# Altium project DISPLAY_T12.PrjPcb
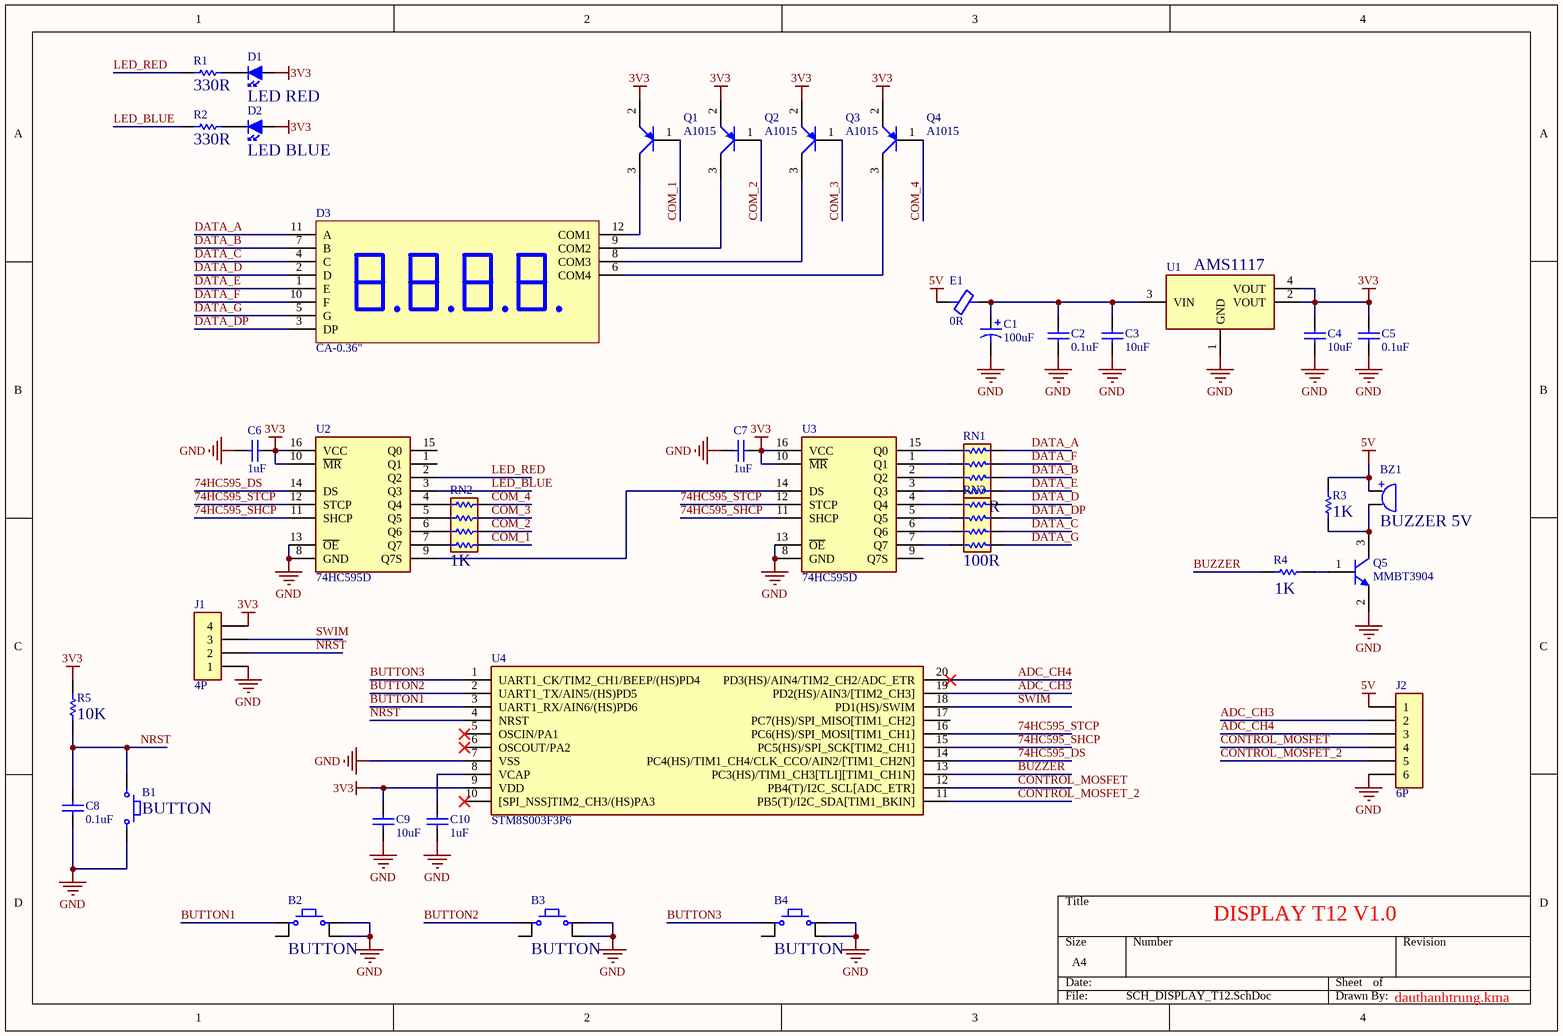
[diagram p0: SCH_DISPLAY_T12.SchDoc]
1 sheet, 38 parts. Net scope: global (net labels, ports and power ports of the same name join across sheets).
Board files: PCB_DISPLAY_T12.PcbDoc, PCB_DISPLAY_BEHIND.PcbDoc

## Sheet SCH_DISPLAY_T12.SchDoc
size A4; SheetNumber: 1; SheetTotal: 1

### Parts
B1  BUTTON  [BUTTON-SMD-2P-3x6x2.5MM]
B2  BUTTON  [BUTTON-SMD-4P-6X6X5MM]
B3  BUTTON  [BUTTON-SMD-4P-6X6X5MM]
B4  BUTTON  [BUTTON-SMD-4P-6X6X5MM]
BZ1  BUZZER 5V  [BUZZER_12095]
C1  100uF  [CAPP-ALU-SMD-6MM]
C2  0.1uF  [CAP_0603]
C3  10uF  [CAP_0805]
C4  10uF  [CAP_0805]
C5  0.1uF  [CAP_0603]
C6  1uF  [CAP_0603]
C7  1uF  [CAP_0603]
C8  0.1uF  [CAP_0603]
C9  10uF  [CAP_0805]
C10  1uF  [CAP_0603]
D1  LED RED  [LED-0603-RED]
D2  LED BLUE  [LED-0603-BLUE]
D3  CA-0.36"  [LED7SEG-0.36-4]
E1  0R  [FB_0805]
J1  4P  [JUMP-2.54-MALE-4P]
J2  6P  [XH2.54-6P]
Q1  A1015  [SOT-23-132]
Q2  A1015  [SOT-23-132]
Q3  A1015  [SOT-23-132]
Q4  A1015  [SOT-23-132]
Q5  MMBT3904  [SOT-23-132]
R1  330R  [RES_0603]
R2  330R  [RES_0603]
R3  1K  [RES_0603]
R4  1K  [RES_0603]
R5  10K  [RES_0603]
RN1  100R  [RES_ARRAY_0603X4]
RN2  1K  [RES_ARRAY_0603X4]
RN3  100R  [RES_ARRAY_0603X4]
U1  AMS1117  [SOT-223]
U2  74HC595D  [SOIC-16]
U3  74HC595D  [SOIC-16]
U4  STM8S003F3P6  [TSSOP-20]

### Nets
3V3: C4.2 C5.2 C6.2 C7.2 C9.2 D1.1(A) D2.1(A) J1.4 Q1.2(E) Q2.2(E) Q3.2(E) Q4.2(E) R5.1 U1.2(VOUT) U1.4(VOUT) U2.10(~{MR}) U2.16(VCC) U3.10(~{MR}) U3.16(VCC) U4.9(VDD)
5V: BZ1.1 E1.1 J2.1 R3.2
GND: B1.2 B2.2 B2.4 B3.2 B3.4 B4.2 B4.4 C1.2(-) C2.1 C3.1 C4.1 C5.1 C6.1 C7.1 C8.2 C9.1 C10.1 J1.1 J2.6 Q5.2(E) U1.1(GND) U2.8(GND) U2.13(~{OE}) U3.8(GND) U3.13(~{OE}) U4.7(VSS)
74HC595_DS: U2.14(DS) U4.14(PC4(HS)/TIM1_CH4/CLK_CCO/AIN2/[TIM1_CH2N])
74HC595_SHCP: U2.11(SHCP) U3.11(SHCP) U4.15(PC5(HS)/SPI_SCK[TIM2_CH1])
74HC595_STCP: U2.12(STCP) U3.12(STCP) U4.16(PC6(HS)/SPI_MOSI[TIM1_CH1])
ADC_CH3: J2.2 U4.19(PD2(HS)/AIN3/[TIM2_CH3])
ADC_CH4: J2.3 U4.20(PD3(HS)/AIN4/TIM2_CH2/ADC_ETR)
BUTTON1: B2.1 U4.3(UART1_RX/AIN6/(HS)PD6)
BUTTON2: B3.1 U4.2(UART1_TX/AIN5/(HS)PD5)
BUTTON3: B4.1 U4.1(UART1_CK/TIM2_CH1/BEEP/(HS)PD4)
BUZZER: R4.1 U4.13(PC3(HS)/TIM1_CH3[TLI][TIM1_CH1N])
COM_1: Q1.1(B) RN2.1
COM_2: Q2.1(B) RN2.2
COM_3: Q3.1(B) RN2.3
COM_4: Q4.1(B) RN2.4
CONTROL_MOSFET: J2.4 U4.12(PB4(T)/I2C_SCL[ADC_ETR])
CONTROL_MOSFET_2: J2.5 U4.11(PB5(T)/I2C_SDA[TIM1_BKIN])
DATA_A: D3.11(A) RN1.1
DATA_B: D3.7(B) RN1.3
DATA_C: D3.4(C) RN3.3
DATA_D: D3.2(D) RN3.1
DATA_DP: D3.3(DP) RN3.2
DATA_E: D3.1(E) RN1.4
DATA_F: D3.10(F) RN1.2
DATA_G: D3.5(G) RN3.4
LED_BLUE: R2.1 U2.3(Q3)
LED_RED: R1.1 U2.2(Q2)
NRST: B1.1 C8.1 J1.2 R5.2 U4.4(NRST)
SWIM: J1.3 U4.18(PD1(HS)/SWIM)
NetBZ1_2: BZ1.2 Q5.3(C) R3.1
NetC1_1: C1.1(+) C2.2 C3.2 E1.2 U1.3(VIN)
NetC10_2: C10.2 U4.8(VCAP)
NetD1_2: D1.2(K) R1.2
NetD2_2: D2.2(K) R2.2
NetD3_6: D3.6(COM4) Q4.3(C)
NetD3_8: D3.8(COM3) Q3.3(C)
NetD3_9: D3.9(COM2) Q2.3(C)
NetD3_12: D3.12(COM1) Q1.3(C)
NetQ5_1: Q5.1(B) R4.2
NetRN1_5: RN1.5 U3.3(Q3)
NetRN1_6: RN1.6 U3.2(Q2)
NetRN1_7: RN1.7 U3.1(Q1)
NetRN1_8: RN1.8 U3.15(Q0)
NetRN2_5: RN2.5 U2.4(Q4)
NetRN2_6: RN2.6 U2.5(Q5)
NetRN2_7: RN2.7 U2.6(Q6)
NetRN2_8: RN2.8 U2.7(Q7)
NetRN3_5: RN3.5 U3.7(Q7)
NetRN3_6: RN3.6 U3.6(Q6)
NetRN3_7: RN3.7 U3.5(Q5)
NetRN3_8: RN3.8 U3.4(Q4)
NetU2_9: U2.9(Q7S) U3.14(DS)

Not connected (* = marked no-connect by the designer): B2 3; B3 3; B4 3; U2 1(Q1) 15(Q0); U3 9(Q7S); U4 5(OSCIN/PA1)* 6(OSCOUT/PA2)* 10([SPI_NSS]TIM2_CH3/(HS)PA3)* 17(PC7(HS)/SPI_MISO[TIM1_CH2])

### Notes on the sheet
- DISPLAY T12 V1.0
- dauthanhtrung.kma
- (in symbol CLA2022) +

### Library data of the parts
B1 = CLA1750: Nút nhấn 2 chân dán 3x6x2.5mm; Manufacture: Linh kiện chất lượng; Partnumber: CLA1750; Value: BUTTON; Creator: dauthanhtrung.kma; Category: BUTTON; Mounting type: SMD; Detailed Value: BUTTON
B2-B4 = CLA1760: Nút nhấn 4 chân 6x6x5mm SMD; Manufacture: Linh kiện chất lượng; Partnumber: CLA1760; Value: BUTTON; Creator: dauthanhtrung.kma; Category: BUTTON; Mounting type: SMD; Detailed Value: BUTTON
BZ1 = CLA2022: Còi chíp 5V 12095 12x9.5mm; Manufacture: Linh kiện chất lượng; Link sale: #http://linhkienchatluong.vn/buzzer---coi-chip---coi-bao/coi-chip-5v-12095-12x95mm_sp798_ct4243.aspx#; Partnumber: CLA2022; Value: BUZZER 5V; Creator: dauthanhtrung.kma; Category: BUZZER; Mounting type: TH; Detailed Value: BUZZER 5V
C1 = CLA1046: Tụ nhôm 16V 100uF 6.3x5.4mm; Manufacture: Linh kiện chất lượng; Detailed Value: 100uF 16V; Partnumber: CLA1046; Value: 100uF; Creator: dauthanhtrung.kma; Category: CAPACITOR; Mounting type: SMD
C2 C5 C8 = CLA4098: Tụ dán 0603 104-100nF 0.1uF 50V 10%; Manufacture: Linh kiện chất lượng; Link sale: #http://linhkienchatluong.vn/tu-dan-0603/tu-dan-0603-104-100nf-01uf-50v-10-10c_sp1063_ct14618.aspx#; Detailed Value: 0603 0.1uF; Partnumber: CLA4098; Value: 0.1uF; Creator: dauthanhtrung.kma; Mounting type: SMD
  C2 C5: Category: CAP
  C8: Category: CAPACITOR
C3 C4 C9 = CLA4020: Tụ dán 0805 106-10uF 16V 10%; Manufacture: Linh kiện chất lượng; Link sale: #http://linhkienchatluong.vn/tu-dan-0805/tu-dan-0805-106-10uf-16v-10-10c_sp1293_ct14702.aspx#; Detailed Value: 0805 10uF; Partnumber: CLA4020; Value: 10uF; Creator: dauthanhtrung.kma; Category: CAP; Mounting type: SMD
C6 C7 C10 = CLA4103: Tụ dán 0603 105-1uF 25V 10%; Manufacture: Linh kiện chất lượng; Link sale: #http://linhkienchatluong.vn/tu-dan-0603/tu-dan-0603-105-1uf-25v-10-10c_sp1063_ct14623.aspx#; Detailed Value: 0603 1uF; Partnumber: CLA4103; Value: 1uF; Creator: dauthanhtrung.kma; Category: CAP; Mounting type: SMD
D1 = CLA3853: LED dán 0603 màu đỏ; Manufacture: Linh kiện chất lượng; Detailed Value: LED 0603 RED; Partnumber: CLA3853; Value: LED RED; Creator: dauthanhtrung.kma; Category: LED; Mounting type: SMD
D2 = CLA3855: LED dán 0603 màu xanh dương; Manufacture: Linh kiện chất lượng; Detailed Value: LED 0603 BLUE; Partnumber: CLA3855; Value: LED BLUE; Creator: dauthanhtrung.kma; Category: LED; Mounting type: SMD
D3 = CLA2087: LED 7 thanh 0.36 inch 4 số màu đỏ A chung 3642BS; Manufacture: Linh kiện chất lượng; Partnumber: CLA2087; Value: CA-0.36"; Creator: dauthanhtrung.kma; Category: LED7SEGMENT; Mounting type: TH; Detailed Value: CA-0.36"
E1 = CL07788: Ferrite Beads 0805 0R; Manufacture: Linh kiện chất lượng; Detailed Value: 0R 0805; Partnumber: CL07788; Value: 0R; Creator: dauthanhtrung.kma; Category: FERRITE; Mounting type: SMD
J1 = JUMP-2.54-MALE-4P: Jump đực đơn 2.54mm 4P chân thẳng; Manufacture: Linh kiện chất lượng; Link sale: #http://linhkienchatluong.vn/jump-254mm/jump-duc-don-254mm-1x40p-chan-thang_sp878_ct1725.aspx#; Partnumber: JUMP-2.54-MALE-4P; Value: 4P; Creator: dauthanhtrung.kma; Category: CONNECTOR; Mounting type: TH; Detailed Value: JUMP-2.54-MALE-4P
J2 = CLA1882: Header đực 6P XH2.54-6P chân thẳng; Manufacture: Linh kiện chất lượng; Link sale: #http://linhkienchatluong.vn/header-xh254-trang/header-duc-6p-xh254-6p-chan-thang-10c_sp861_ct1715.aspx#; Partnumber: CLA1882; Value: 6P; Creator: dauthanhtrung.kma; Category: CONNECTOR; Mounting type: TH; Detailed Value: XH2.54-6P
Q1-Q4 = CL08753: A1015 PNP Transistor 0.15A 60V SOT-23; Manufacture: Linh kiện chất lượng; Partnumber: CL08753; Value: A1015; Creator: dauthanhtrung.kma; Category: TRANSISTOR; Mounting type: SMD; Detailed Value: A1015 PNP
Q5 = CL00042: 2N3904 MMBT3904 1AM NPN Transistor 0.2A 40V SOT-23; Manufacture: Linh kiện chất lượng; Detailed Value: MMBT3904 NPN SOT-23; Partnumber: CL00042; Value: MMBT3904; Creator: dauthanhtrung.kma; Category: TRANSISTOR; Mounting type: SMD
R1 R2 = CL06621: Điện trở dán 0603 330R 1%; Manufacture: Linh kiện chất lượng; Link sale: #http://linhkienchatluong.vn/dien-tro-dan-0603-116w/dien-tro-dan-0603-330r-1-50c_sp836_ct8907.aspx#; Partnumber: CL06621; Value: 330R; Creator: dauthanhtrung.kma; Category: RES; Mounting type: SMD; Detailed Value: 0603 330R
R3 R4 = CLA0742: Điện trở dán 0603 1K 1%; Manufacture: Linh kiện chất lượng; Link sale: #http://linhkienchatluong.vn/dien-tro-dan-0603-116w/dien-tro-dan-0603-1k-1-50c_sp836_ct5772.aspx#; Detailed Value: 0603 1K; Partnumber: CLA0742; Value: 1K; Creator: dauthanhtrung.kma; Category: RES; Mounting type: SMD
R5 = CLA0759: Điện trở dán 0603 10K 1%; Manufacture: Linh kiện chất lượng; Link sale: #http://linhkienchatluong.vn/dien-tro-dan-0603-116w/dien-tro-dan-0603-10k-1-50c_sp836_ct5792.aspx#; Partnumber: CLA0759; Value: 10K; Creator: dauthanhtrung.kma; Category: RESISTOR; Mounting type: SMD; Detailed Value: 0603  10K
RN1 RN3 = CLA0906: Điện trở băng 0603x4 100R 8P4R; Manufacture: Linh kiện chất lượng; Detailed Value: 100R ARRAY 0603; Partnumber: CLA0906; Value: 100R; Creator: dauthanhtrung.kma; Category: TRANSISTOR; Mounting type: SMD
RN2 = CLA0909: Điện trở băng 0603x4 1K 8P4R; Manufacture: Linh kiện chất lượng; Detailed Value: RES ARRAY 0603 1K; Partnumber: CLA0909; Value: 1K; Creator: dauthanhtrung.kma; Category: TRANSISTOR; Mounting type: SMD
U1 = CL00249: AMS1117-3.3V IC ổn áp 3.3V 1A SOT-223; Manufacture: Linh kiện chất lượng; Link sale: #http://linhkienchatluong.vn/ho-ams--1117/ams1117-33v-ic-on-ap-33v-1a-sot-223_sp1008_ct371.aspx#; Partnumber: CL00249; Value: AMS1117; Creator: dauthanhtrung.kma; Category: IC; Mounting type: SMD; Detailed Value: AMS1117-3.3V
U2 U3 = CL00146: 74HC595D SOP-16 3.9mm chính hãng NXP; MP: STM8S003F3P6; MF: STMicroelectronics; Availability: Unavailable; SnapEDA_Link: https://www.snapeda.com/parts/STM8S003F3P6/STMicroelectronics/view-part/47650/?ref=snap; Price: None; Value: 74HC595D; Package: TSSOP-20 STMicroelectronics; Partnumber: CL00146; Manufacture: NXP; Creator: dauthanhtrung.kma; Category: IC; Mounting type: SMD; Detailed Value: 74HC595D SOP-16
U4 = CL00897: STM8S003F3P6 TSSOP-20; MF: STMicroelectronics; Availability: Unavailable; SnapEDA_Link: https://www.snapeda.com/parts/STM8S003F3P6/STMicroelectronics/view-part/47650/?ref=snap; MP: STM8S003F3P6; Price: None; Value: STM8S003F3P6; Package: TSSOP-20 STMicroelectronics; Partnumber: CL00897; Manufacture: STMicroelectronics; Creator: dauthanhtrung.kma; Category: IC; Mounting type: SMD; Detailed Value: STM8S003F3P6 TSSOP-20

## Assembly variants
DISPLAY_T12 V1.0.0: not fitted J1